# EAGLE design LVSevenSegmentDriver (EAGLE 7.5.0)
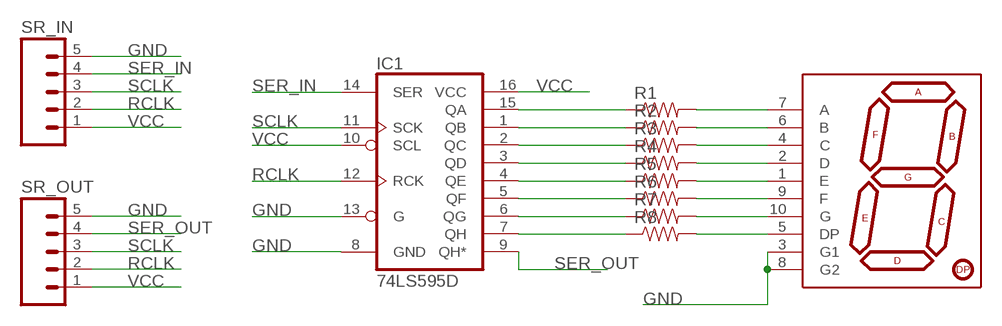
[diagram p0: schematic, sheet 1]

## Parts
IC1  74LS595D  [SO16]
R1  RESISTOR1206  [1206]
R2  RESISTOR1206  [1206]
R3  RESISTOR1206  [1206]
R4  RESISTOR1206  [1206]
R5  RESISTOR1206  [1206]
R6  RESISTOR1206  [1206]
R7  RESISTOR1206  [1206]
R8  RESISTOR1206  [1206]
SR_IN  M05PTH  [1X05]
SR_OUT  M05PTH  [1X05]
U$1  7-SEGMENT-DISPLAY-1"-REDEZ  [7-SEGMENT-1"PTH-EZ]

## Nets
GND: IC1.8(GND) IC1.13(G) SR_IN.5 SR_OUT.5 U$1.3(G1) U$1.8(G2)
N$1: IC1.15(QA) R1.1
N$2: R1.2 U$1.7(A)
N$3: IC1.1(QB) R2.1
N$4: R2.2 U$1.6(B)
N$5: IC1.2(QC) R3.1
N$6: R3.2 U$1.4(C)
N$7: IC1.3(QD) R4.1
N$8: R4.2 U$1.2(D)
N$9: IC1.4(QE) R5.1
N$10: R5.2 U$1.1(E)
N$11: IC1.5(QF) R6.1
N$12: R6.2 U$1.9(F)
N$13: IC1.6(QG) R7.1
N$14: R7.2 U$1.10(G)
N$15: IC1.7(QH) R8.1
N$16: R8.2 U$1.5(DP)
RCLK: IC1.12(RCK) SR_IN.2 SR_OUT.2
SCLK: IC1.11(SCK) SR_IN.3 SR_OUT.3
SER_IN: IC1.14(SER) SR_IN.4
SER_OUT: IC1.9(QH*) SR_OUT.4
VCC: IC1.10(SCL) IC1.16(VCC) SR_IN.1 SR_OUT.1

## Library data of the parts
IC1 = SparkFun-DigitalIC:74*595: 8-bit SHIFT REGISTER, output latch; PROD_ID: IC-07875
R1-R8 = SparkFun-Resistors:RESISTOR: Resistor Basic schematic elements and footprints for 0603, 1206, and PTH resistors.
SR_IN SR_OUT = SparkFun-Connectors:M05: Header 5 Standard 5-pin 0.1" header. Use with straight break away headers (SKU : PRT-00116), right angle break away headers (PRT-00553), swiss pins (PRT-00743), machine pins (PRT-00117), and female headers (PRT-00115). Molex polarized connector foot print use with SKU : PRT-08230 with associated crimp pins and housings.
U$1 = SparkFun-Displays:7-SEGMENT-DISPLAY-1"-RED: 7-Segment Display 1" Red (COM-08546) EZ is for kits. Pads are only exposed on the bottom side to help prevent soldering in upside down.

## Net classes
0 default: width 0.406 mm, drill 0.381 mm, clearance 0.305 mm

## Board
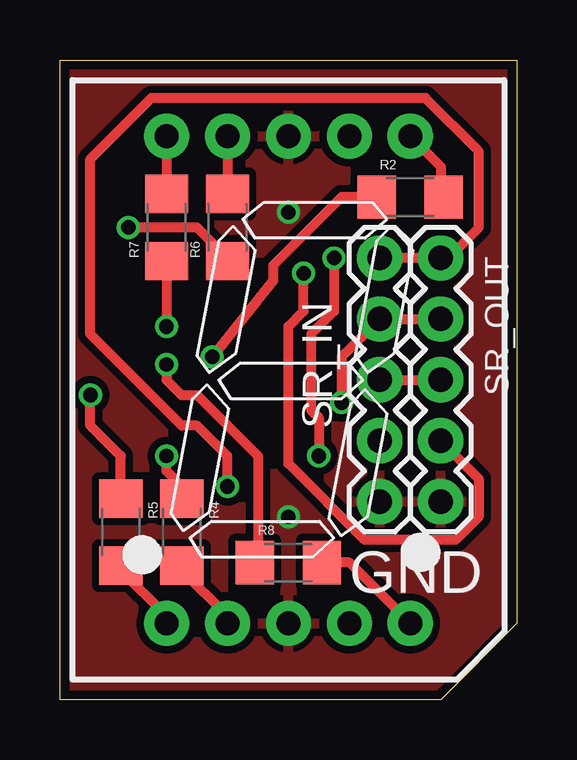
[diagram p1: board, top side]
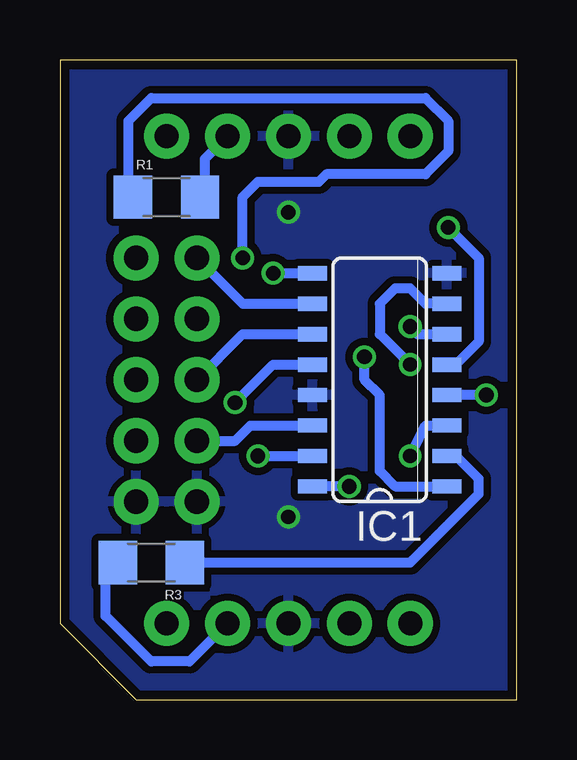
[diagram p2: board, bottom side, seen from below]

Size 19.05 x 26.67 mm. Coordinates in mm from the lower left corner, seen from the top.
Outline: 0,0 0,26.67 19.05,26.67 19.05,3.17 15.88,0 0,0
Copper layers (1*16): Top 0.0356mm / dielectric 1.5011mm / Bottom 0.0356mm
Design rules "oshpark-2layer": minimum track width 6mil, minimum drill 13mil, track to track 6mil, track to pad 6mil, pad to pad 6mil, via to via 6mil, smd to smd 6mil, copper to edge 15mil, drill to drill 6mil, minimum pad ring 7mil, minimum via ring 7mil, stop-mask expansion 2.5mil, vias tented up to drill 0mil, thermal gap 10mil

### Footprints (pad centres in the part's own frame; a part is rotated, then mirrored left to right if it is on the bottom)
SO16 = smd 0.6 x 1.2: 1 -4.445,-2.8; 2 -3.175,-2.8; 3 -1.905,-2.8; 4 -0.635,-2.8; 5 0.635,-2.8; 6 1.905,-2.8; 7 3.175,-2.8; 8 4.445,-2.8; 9 4.445,2.8; 10 3.175,2.8; 11 1.905,2.8; 12 0.635,2.8; 13 -0.635,2.8; 14 -1.905,2.8; 15 -3.175,2.8; 16 -4.445,2.8
1206 = smd 1.6 x 1.8: 1 -1.4,0; 2 1.4,0
1X05 = drill 1.016 pad 1.88: 1 0,0; 2 2.54,0; 3 5.08,0; 4 7.62,0; 5 10.16,0
7-SEGMENT-1"PTH-EZ = drill 1 pad 1.88: 1 -5.08,-10.16; 2 -2.54,-10.16; 3 0,-10.16; 4 2.54,-10.16; 5 5.08,-10.16; 6 5.08,10.16; 7 2.54,10.16; 8 0,10.16; 9 -2.54,10.16; 10 -5.08,10.16

### Placement (x,y rotation side)
IC1  5.71,13.33 90 bottom
R1  14.61,20.96 0 bottom
R2  14.61,20.96 0 top
R3  15.24,5.71 180 bottom
R4  5.08,6.98 270 top
R5  2.54,6.98 270 top
R6  6.98,19.69 90 top
R7  4.45,19.69 90 top
R8  9.53,5.71 0 top
SR_IN  13.33,18.42 270 top
SR_OUT  15.88,18.42 270 top
U$1  9.53,13.33 0 top

### Tracks (layer width: path | path; a pad name or v marks a point on that pad's centre or on a via)
GND  (via drill 0.6)
  other vias: 9.53,20.32 9.53,7.62
  pour Bottom: 0,26.67 19.05,26.67 19.05,3.17 15.88,0 0,0
  pour Top: 0,26.67 19.05,26.67 19.05,3.17 15.88,0 0,0
N$1  (via drill 0.61)
  Top 0.406: v10.79,10.16 10.79,11.75 10.48,12.06 10.48,15.24 11.43,16.19 v11.43,18.42
  Bottom 0.406: v10.79,10.16 IC1.15 | R1.1 16.19,20.96 16.19,24.13 15.24,25.08 3.81,25.08 2.86,24.13 2.86,22.86 3.81,21.91 7.94,21.91 8.26,21.59 10.79,21.59 11.43,20.96 v11.43,18.42
N$2
  Bottom 0.406: U$1.7 13.02,22.54 13.02,20.96 R1.2
N$3  (via drill 0.61)
  Top 0.406: v6.35,14.29 8.89,17.46 8.89,18.1 11.75,20.96 R2.1
  Bottom 0.406: IC1.1 5.08,8.89 5.71,9.53 5.71,12.7 6.35,13.33 v6.35,14.29
N$4
  Top 0.406: U$1.6 15.88,22.23 15.88,20.96 R2.2
N$5
  Bottom 0.406: IC1.2 2.54,10.16 1.59,9.21 1.59,8.57 4.45,5.71 R3.1
N$6
  Bottom 0.406: U$1.4 13.65,1.59 15.24,1.59 17.15,3.49 17.15,5.71 R3.2
N$7  (via drill 0.6)
  Top 0.406: R4.1 5.08,8.89 4.45,9.53 v4.45,10.16
  Bottom 0.406: v4.45,10.16 3.81,11.43 IC1.3
N$8
  Top 0.406: U$1.2 6.98,3.49 5.08,5.4 R4.2
N$9  (via drill 0.61)
  Top 0.406: v1.27,12.7 1.27,11.43 2.54,10.16 R5.1
  Bottom 0.406: v1.27,12.7 IC1.4
N$10
  Top 0.406: U$1.1 4.45,3.49 2.54,5.4 R5.2
N$11  (via drill 0.61)
  Top 0.406: v2.86,19.69 5.71,19.69 6.98,18.42 R6.1
  Bottom 0.406: IC1.5 2.54,13.97 1.59,14.92 1.59,18.42 v2.86,19.69
N$12
  Top 0.406: U$1.9 R6.2
N$13  (via drill 0.61)
  Top 0.406: R7.1 v4.45,15.56
  Bottom 0.406: IC1.6 4.13,15.24 v4.45,15.56
N$14
  Top 0.406: U$1.10 R7.2
N$15  (via drill 0.6)
  Top 0.406: 8.26,5.71 R8.1 8.26,5.84 8.26,10.16 5.71,12.7 5.08,12.7 4.45,13.33 v4.45,13.97
  Bottom 0.406: v4.45,13.97 5.71,15.24 5.71,16.51 5.08,17.15 4.45,17.15 3.81,16.51 IC1.7
N$16
  Top 0.406: R8.2 12.06,5.71 U$1.5
RCLK  (via drill 0.61)
  Top 0.406: v11.75,12.38 11.75,14.29 SR_IN.2 SR_OUT.2
  Bottom 0.406: IC1.12 10.16,13.97 v11.75,12.38
SCLK
  Top 0.406: SR_IN.3 SR_OUT.3
  Bottom 0.406: IC1.11 11.43,15.24 SR_IN.3
SER_IN
  Bottom 0.406: IC1.14 11.11,11.43 11.75,10.79 SR_IN.4
SER_OUT  (via drill 0.61)
  Top 0.406: v10.16,17.78 10.16,16.19 9.53,15.56 9.53,9.84 12.7,6.67 16.51,6.67 17.46,7.62 17.46,9.21 SR_OUT.4
  Bottom 0.406: v10.16,17.78 IC1.9
VCC  (via drill 0.61)
  Top 0.406: SR_IN.1 SR_OUT.1 16.19,18.42 17.46,19.69 17.46,22.86 15.24,25.08 3.81,25.08 1.27,22.54 1.27,15.24 5.08,11.43 5.71,11.43 6.98,10.16 v6.98,8.89
  Bottom 0.406: IC1.10 11.43,16.51 SR_IN.1 | v6.98,8.89 IC1.16

### Text on the board
tNames: GND